# Altium schematic sheet Battery.SchDoc
size A4
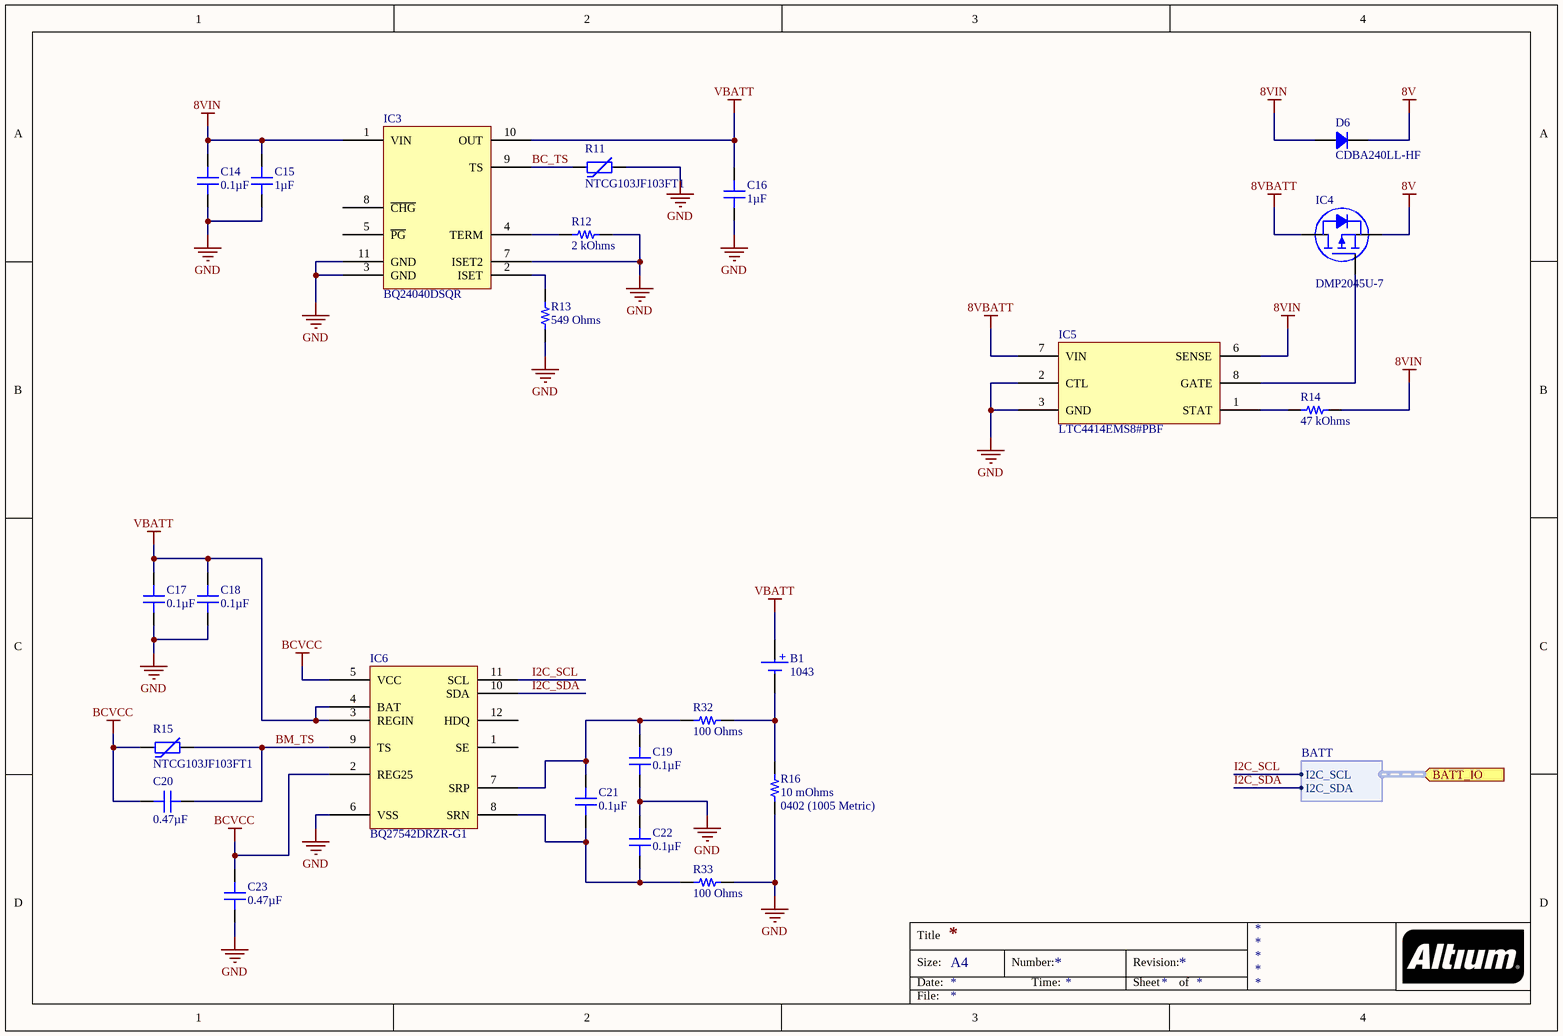
[diagram p0: Battery.SchDoc]

## Parts
B1  1043  [KEYSTONE 1043]
C14  0.1µF  [CAP 0201_0603]
C15  1µF  [CAP 0402_1005]
C16  1µF  [CAP 0402_1005]
C17  0.1µF  [CAP 0201_0603]
C18  0.1µF  [CAP 0201_0603]
C19  0.1µF  [CAP 0201_0603]
C20  0.47µF  [CAP 0201_0603]
C21  0.1µF  [CAP 0201_0603]
C22  0.1µF  [CAP 0201_0603]
C23  0.47µF  [CAP 0201_0603]
D6  CDBA240LL-HF  [DO214AC SMA]
IC3  BQ24040DSQR  [TI PWSON-10 DSQ]
IC4  DMP2045U-7  [DIODES SOT-23-3]
IC5  LTC4414EMS8#PBF  [ANALOG MSOP-8 RM-8]
IC6  BQ27542DRZR-G1  [TI SON-12 DRZ]
R11  NTCG103JF103FT1  [NTC 0402_1005]
R12  2 kOhms  [RES 0201_0603]
R13  549 Ohms  [RES 0201_0603]
R14  47 kOhms  [RES 0201_0603]
R15  NTCG103JF103FT1  [NTC 0402_1005]
R16  10 mOhms  Package / Case: 0402 (1005 Metric)  [STACKPOLE CSR0402]
R32  100 Ohms  [RES 0201_0603]
R33  100 Ohms  [RES 0201_0603]

## Ports
BATT_IO (in, harness BATT)

## Harnesses
BATT: I2C_SCL, I2C_SDA

## Nets
8V: D6.2 IC4.2(S)
8VBATT: IC4.3(D) IC5.7(VIN)
8VIN: C14.2 C15.2 D6.1 IC3.1(VIN) IC5.6(SENSE) R14.2
BCVCC: C20.1 C23.2 IC6.2(REG25) IC6.5(VCC) R15.1
GND: C14.1 C15.1 C16.1 C17.1 C18.1 C19.1 C22.2 C23.1 IC3.3(GND) IC3.7(ISET2) IC3.11(GND) IC5.2(CTL) IC5.3(GND) IC6.6(VSS) R11.2 R12.2 R13.1 R16.1 R33.2
VBATT: B1.1(+) C16.2 C17.2 C18.2 IC3.10(OUT) IC6.3(REGIN) IC6.4(BAT)
BC_TS: IC3.9(TS) R11.1
BM_TS: C20.2 IC6.9(TS) R15.2
I2C_SCL: IC6.11(SCL) ; port BATT_IO.I2C_SCL
I2C_SDA: IC6.10(SDA) ; port BATT_IO.I2C_SDA
NetB1_2: B1.2(-) R16.2 R32.2
NetC19_2: C19.2 C21.2 IC6.7(SRP) R32.1
NetC21_1: C21.1 C22.1 IC6.8(SRN) R33.1
NetIC3_2: IC3.2(ISET) R13.2
NetIC3_4: IC3.4(TERM) R12.1
NetIC4_1: IC4.1(G) IC5.8(GATE)
NetIC5_1: IC5.1(STAT) R14.1

Not connected (* = marked no-connect by the designer): IC3 5(~{PG}) 8(~{CHG}); IC6 1(SE) 12(HDQ)

## Notes on the sheet
- Title
- Size:
- Date:
- A4
- Number:
- Time:
- Revision:
- Sheet
- of
- File:

## Library data of the parts
B1 = 1043: BATTERY HOLDER 18650 PC PIN; Manufacturer: Keystone Electronics; Battery Cell Size: 18650; Battery Type, Function: Cylindrical, Holder; Number of Cells: 1; Style: Holder (Open); Part Number: 1043; ComponentLink1Description: Datasheet; ComponentLink1URL: http://keyelco.com/userAssets/file/M65p27.pdf; ComponentLink2Description: DigiKey Link; ComponentLink2URL: http://digikey.com/product-detail/en/keystone-electronics/1043/36-1043-ND/2745669; Height Above Board: 0.585" (14.86mm); LastUpdated: 02/02/2020 09:19:56; Lifecycle Status: Active; Minimum Order: 1; Mounting Type: PCB, Through Hole; Operating Temperature: -50°C ~ 145°C; Packaging: Unknown; PartId: 2; Part Status: Active; Price: 2.58; Series: -; Supplier 1: DigiKey; Supplier Part Number 1: 36-1043-ND; Termination Style: PC Pin
C14 C17-C19 C21 C22 = GRM033R61C104ME84D: CAP CER 0.1UF 16V X5R 0201; Manufacturer: Murata Electronics; Tolerance: ±20%; Part Number: GRM033R61C104ME84D; Value: 0.1µF; Applications: General Purpose; Capacitance: 0.1µF; ComponentLink1Description: Datasheet; ComponentLink1URL: https://search.murata.co.jp/Ceramy/image/img/A01X/G101/ENG/GRM033R61C104ME84-01.pdf; ComponentLink2Description: DigiKey Link; ComponentLink2URL: http://digikey.com/product-detail/en/murata-electronics/GRM033R61C104ME84D/490-9986-1-ND/5026291; Device Package: 0201 (0603 Metric); LastUpdated: 21/01/2020 00:00:12; Lifecycle Status: Active; Minimum Order: 1; Mounting Type: Surface Mount, MLCC; Operating Temperature: -55°C ~ 85°C; Package / Case: 0201 (0603 Metric); Packaging: TapeAndReel; PartId: 1522; Part Status: Active; Price: 0.01; Series: GRM; Size / Dimension: 0.024" L x 0.012" W (0.60mm x 0.30mm); Supplier 1: DigiKey; Supplier Part Number 1: 490-9986-1-ND; Temperature Coefficient: X5R; Thickness (Max): 0.013" (0.33mm); Voltage - Rated: 16V
C15 C16 = GRM155R61C105MA12D: CAP CER 1UF 16V X5R 0402; Manufacturer: Murata Electronics; Tolerance: ±20%; Part Number: GRM155R61C105MA12D; Value: 1µF; Applications: General Purpose; Capacitance: 1µF; ComponentLink1Description: Datasheet; ComponentLink1URL: https://search.murata.co.jp/Ceramy/image/img/A01X/G101/ENG/GRM155R61C105MA12-01.pdf; ComponentLink2Description: DigiKey Link; ComponentLink2URL: http://digikey.com/product-detail/en/murata-electronics/GRM155R61C105MA12D/490-14599-1-ND/6606205; Device Package: 0402 (1005 Metric); LastUpdated: 01/04/2020 23:56:41; Lifecycle Status: Active; Minimum Order: 1; Mounting Type: Surface Mount, MLCC; Operating Temperature: -55°C ~ 85°C; Package / Case: 0402 (1005 Metric); Packaging: TapeAndReel; PartId: 10295; Part Status: Active; Price: 0.01; Series: GRM; Size / Dimension: 0.039" L x 0.020" W (1.00mm x 0.50mm); Supplier 1: DigiKey; Supplier Part Number 1: 490-14599-1-ND; Temperature Coefficient: X5R; Thickness (Max): 0.022" (0.55mm); Voltage - Rated: 16V
C20 C23 = GRM033R60J474ME90D: CAP CER 0.47UF 6.3V X5R 0201; Manufacturer: Murata Electronics; Tolerance: ±20%; Part Number: GRM033R60J474ME90D; Value: 0.47µF; Applications: General Purpose; Capacitance: 0.47µF; ComponentLink1Description: Datasheet; ComponentLink1URL: https://search.murata.co.jp/Ceramy/image/img/A01X/G101/ENG/GRM033R60J474ME90-01.pdf; ComponentLink2Description: DigiKey Link; ComponentLink2URL: http://digikey.com/product-detail/en/murata-electronics/GRM033R60J474ME90D/490-10410-1-ND/5026287; Device Package: 0201 (0603 Metric); LastUpdated: 21/01/2020 00:00:17; Lifecycle Status: Active; Minimum Order: 1; Mounting Type: Surface Mount, MLCC; Operating Temperature: -55°C ~ 85°C; Package / Case: 0201 (0603 Metric); Packaging: TapeAndReel; PartId: 705; Part Status: Active; Price: 0.02; Series: GRM; Size / Dimension: 0.024" L x 0.012" W (0.60mm x 0.30mm); Supplier 1: DigiKey; Supplier Part Number 1: 490-10410-1-ND; Temperature Coefficient: X5R; Thickness (Max): 0.013" (0.33mm); Voltage - Rated: 6.3V
D6 = CDBA240LL-HF: DIODE SCHOTTKY 40V 2A DO214AC; Manufacturer: Comchip Technology; Capacitance @ Vr, F: 160pF @ 4V, 1MHz; Current - Average Rectified (Io): 2A (DC); Current - Reverse Leakage @ Vr: 1mA @ 40V; Speed: Fast Recovery =< 500ns, > 200mA (Io); Voltage - Forward (Vf) (Max) @ If: 350mV @ 2A; Part Number: CDBA240LL-HF; ComponentLink1Description: Datasheet; ComponentLink1URL: http://www.comchiptech.com/admin/files/product/CDBA240LL-HF RevC514247.pdf; ComponentLink2Description: DigiKey Link; ComponentLink2URL: http://digikey.com/product-detail/en/comchip-technology/CDBA240LL-HF/641-1698-1-ND/5226081; Device Package: DO-214AC, SMA; Diode Type: Schottky; LastUpdated: 02/02/2020 10:17:39; Lifecycle Status: Active; Minimum Order: 1; Mounting Type: Surface Mount; Operating Temperature - Junction: -55°C ~ 100°C; Package / Case: DO-214AC, SMA; Packaging: TapeAndReel; PartId: 2082; Part Status: Active; Price: 0.15; Series: -; Supplier 1: DigiKey; Supplier Part Number 1: 641-1698-1-ND; Supplier Device Package: DO-214AC (SMA); Voltage - DC Reverse (Vr) (Max): 40V
IC3 = BQ24040DSQR: IC BATT CHG LI-ION 1 CELL 10SON; Manufacturer: Texas Instruments; Battery Chemistry: Lithium Ion/Polymer; Battery Pack Voltage: 4.2V; Charge Current - Max: 1A; Current - Charging: Constant - Programmable; Fault Protection: Over Temperature, Over Voltage, Short Circuit; Number of Cells: 1; Programmable Features: Current; Voltage - Supply (Max): 28V; Part Number: BQ24040DSQR; ComponentLink1Description: Datasheet; ComponentLink1URL: http://www.ti.com/general/docs/suppproductinfo.tsp?distId=10&gotoUrl=http%3A%2F%2Fwww.ti.com%2Flit%2Fgpn%2Fbq24040; ComponentLink2Description: DigiKey Link; ComponentLink2URL: //digikey.com/product-detail/en/texas-instruments/BQ24040DSQR/296-37142-2-ND/2231631; Device Package: 10-WFDFN Exposed Pad; LastUpdated: 03/12/2019 23:44:47; Lifecycle Status: 0; Minimum Order: 1; Mounting Type: Surface Mount; Operating Temperature: -40°C ~ 85°C (TA); Package / Case: 10-WFDFN Exposed Pad; Packaging: TapeAndReel; PartId: 3; Part Status: Active; Price: 0.49; Series: -; Supplier 1: DigiKey; Supplier Part Number 1: 296-37142-2-ND; Supplier Device Package: 10-SON (2x2)
IC4 = DMP2045U-7: MOSFET P-CHAN 24V SOT23; Manufacturer: Diodes Incorporated; Current - Continuous Drain (Id) @ 25°C: 4.3A (Ta); Drain to Source Voltage (Vdss): 20V; Drive Voltage (Max Rds On,  Min Rds On): 1.8V, 4.5V; FET Type: P-Channel; Gate Charge (Qg) (Max) @ Vgs: 6.8nC @ 4.5V; Input Capacitance (Ciss) (Max) @ Vds: 634pF @ 10V; Power Dissipation (Max): 800mW (Ta); Rds On (Max) @ Id, Vgs: 45mOhm @ 4A, 4.5V; Vgs (Max): ±8V; Vgs(th) (Max) @ Id: 1V @ 250µA; Part Number: DMP2045U-7; ComponentLink1Description: Datasheet; ComponentLink1URL: https://www.diodes.com/assets/Datasheets/DMP2045U.pdf; ComponentLink2Description: DigiKey Link; ComponentLink2URL: http://digikey.com/product-detail/en/diodes-incorporated/DMP2045U-7/DMP2045U-7DICT-ND/8275359; Device Package: TO-236-3, SC-59, SOT-23-3; LastUpdated: 21/01/2020 04:00:36; Lifecycle Status: Active; Minimum Order: 1; Mounting Type: Surface Mount; Operating Temperature: -55°C ~ 150°C (TJ); Package / Case: TO-236-3, SC-59, SOT-23-3; Packaging: TapeAndReel; Part Status: Active; Price: 0.08; Series: -; Supplier 1: DigiKey; Supplier Part Number 1: DMP2045U-7DICT-ND; Supplier Device Package: SOT-23; Technology: MOSFET (Metal Oxide)
IC5 = LTC4414EMS8#PBF: IC OR CTRLR SRC SELECT 8MSOP; Manufacturer: Linear Technology/Analog Devices; Current - Supply: 33µA; Delay Time - OFF: 20µs; Delay Time - ON: 600µs; FET Type: P-Channel; Internal Switch(s): No; Ratio - Input:Output: 2:1; Voltage - Supply: 3V ~ 36V; Applications: Battery Backup, Industrial/Automotive, High Current Switch; ComponentLink1Description: Datasheet; ComponentLink1URL: http://www.linear.com/docs/9037; ComponentLink2Description: DigiKey Link; ComponentLink2URL: http://digikey.com/product-detail/en/linear-technology-analog-devices/LTC4414EMS8-PBF/LTC4414EMS8-PBF-ND/1620230; Device Package: 8-TSSOP, 8-MSOP (0.118", 3.00mm Width); LastUpdated: 02/02/2020 11:30:26; Lifecycle Status: Active; Part Number: LTC4414EMS8#PBF; Minimum Order: 1; Mounting Type: Surface Mount; Operating Temperature: -40°C ~ 85°C; Package / Case: 8-TSSOP, 8-MSOP (0.118", 3.00mm Width); Packaging: Tube; Part Status: Active; Price: 4.49; Series: PowerPath™; Supplier 1: DigiKey; Supplier Part Number 1: LTC4414EMS8#PBF-ND; Supplier Device Package: 8-MSOP; Type: Source Selector Switch
IC6 = BQ27542DRZR-G1: IC BATT FUEL GAUGE LI-ION 12SON; Manufacturer: Texas Instruments; Battery Chemistry: Lithium-Ion; Function: Battery Monitor; Interface: HDQ, I²C; Number of Cells: 1; Part Number: BQ27542DRZR-G1; ComponentLink1Description: Datasheet; ComponentLink1URL: http://www.ti.com/general/docs/suppproductinfo.tsp?distId=10&gotoUrl=http%3A%2F%2Fwww.ti.com%2Flit%2Fgpn%2Fbq27542-g1; ComponentLink2Description: DigiKey Link; ComponentLink2URL: http://digikey.com/product-detail/en/texas-instruments/BQ27542DRZR-G1/296-44346-1-ND/6110619; Device Package: 12-VFDFN Exposed Pad; LastUpdated: 30/03/2020 16:23:27; Lifecycle Status: Active; Minimum Order: 1; Mounting Type: Surface Mount; Operating Temperature: -40°C ~ 85°C (TA); Package / Case: 12-VFDFN Exposed Pad; Packaging: TapeAndReel; Part Status: Active; Price: 1.28; Series: Impedance Track™; Supplier 1: DigiKey; Supplier Part Number 1: 296-44346-1-ND; Supplier Device Package: 12-SON (2.5x4)
R11 R15 = NTCG103JF103FT1: THERMISTOR NTC 10KOHM 3380K 0402; Manufacturer: TDK Corporation; B25/85: 3435K; B Value Tolerance: ±1%; Power - Max: 100mW; Resistance in Ohms @ 25°C: 10k; Part Number: NTCG103JF103FT1; B25/50: 3380K; ComponentLink1Description: Datasheet; ComponentLink1URL: https://product.tdk.com/info/en/catalog/datasheets/503021/tpd_commercial_ntc-thermistor_ntcg_en.pdf?ref_disty=digikey; ComponentLink2Description: DigiKey Link; ComponentLink2URL: http://digikey.com/product-detail/en/tdk-corporation/NTCG103JF103FT1/445-2550-1-ND/934249; Device Package: 0402 (1005 Metric); LastUpdated: 21/01/2020 03:30:28; Lifecycle Status: Active; Minimum Order: 1; Mounting Type: Surface Mount; Operating Temperature: -40°C ~ 125°C; Package / Case: 0402 (1005 Metric); Packaging: TapeAndReel; PartId: 199; Part Status: Active; Price: 0.03; Resistance Tolerance: ±1%; Series: NTCG; Supplier 1: DigiKey; Supplier Part Number 1: 445-2550-1-ND
R12 = ERJ-1GNF2001C: RES SMD 2K OHM 1% 1/20W 0201; Manufacturer: Panasonic Electronic Components; Power (Watts): 0.05W, 1/20W; Temperature Coefficient: ±200ppm/°C; Part Number: ERJ-1GNF2001C; Value: 2 kOhms; ComponentLink1Description: Datasheet; ComponentLink1URL: https://industrial.panasonic.com/cdbs/www-data/pdf/RDA0000/AOA0000C304.pdf; ComponentLink2Description: DigiKey Link; ComponentLink2URL: http://digikey.com/product-detail/en/panasonic-electronic-components/ERJ-1GNF2001C/P122812CT-ND/8342563; Composition: Thick Film; Device Package: 0201 (0603 Metric); Features: Automotive AEC-Q200; Height - Seated (Max): 0.010" (0.26mm); LastUpdated: 21/01/2020 00:04:11; Lifecycle Status: Active; Minimum Order: 1; Number of Terminations: 2; Operating Temperature: -55°C ~ 125°C; Package / Case: 0201 (0603 Metric); Packaging: TapeAndReel; PartId: 3463; Part Status: Active; Price: 0.01; Ratings: AEC-Q200; Resistance: 2 kOhms; Series: ERJ; Size / Dimension: 0.024" L x 0.012" W (0.60mm x 0.30mm); Supplier 1: DigiKey; Supplier Part Number 1: P122812CT-ND; Supplier Device Package: 0201; Tolerance: ±1%
R13 = ERJ-1GNF5490C: RES SMD 549 OHM 1% 1/20W 0201; Manufacturer: Panasonic Electronic Components; Power (Watts): 0.05W, 1/20W; Temperature Coefficient: ±200ppm/°C; Part Number: ERJ-1GNF5490C; Value: 549 Ohms; ComponentLink1Description: Datasheet; ComponentLink1URL: https://industrial.panasonic.com/cdbs/www-data/pdf/RDA0000/AOA0000C304.pdf; ComponentLink2Description: DigiKey Link; ComponentLink2URL: http://digikey.com/product-detail/en/panasonic-electronic-components/ERJ-1GNF5490C/P123070CT-ND/8343079; Composition: Thick Film; Device Package: 0201 (0603 Metric); Features: Automotive AEC-Q200; Height - Seated (Max): 0.010" (0.26mm); LastUpdated: 21/01/2020 00:04:10; Lifecycle Status: Active; Minimum Order: 1; Number of Terminations: 2; Operating Temperature: -55°C ~ 125°C; Package / Case: 0201 (0603 Metric); Packaging: TapeAndReel; PartId: 4182; Part Status: Active; Price: 0.01; Ratings: AEC-Q200; Resistance: 549 Ohms; Series: ERJ; Size / Dimension: 0.024" L x 0.012" W (0.60mm x 0.30mm); Supplier 1: DigiKey; Supplier Part Number 1: P123070CT-ND; Supplier Device Package: 0201; Tolerance: ±1%
R14 = ERJ-1GNF4702C: RES SMD 47K OHM 1% 1/20W 0201; Manufacturer: Panasonic Electronic Components; Power (Watts): 0.05W, 1/20W; Temperature Coefficient: ±200ppm/°C; Part Number: ERJ-1GNF4702C; Value: 47 kOhms; ComponentLink1Description: Datasheet; ComponentLink1URL: https://industrial.panasonic.com/cdbs/www-data/pdf/RDA0000/AOA0000C304.pdf; ComponentLink2Description: DigiKey Link; ComponentLink2URL: http://digikey.com/product-detail/en/panasonic-electronic-components/ERJ-1GNF4702C/P123032CT-ND/8343003; Composition: Thick Film; Device Package: 0201 (0603 Metric); Features: Automotive AEC-Q200; Height - Seated (Max): 0.010" (0.26mm); LastUpdated: 21/01/2020 00:04:13; Lifecycle Status: Active; Minimum Order: 1; Number of Terminations: 2; Operating Temperature: -55°C ~ 125°C; Package / Case: 0201 (0603 Metric); Packaging: TapeAndReel; PartId: 2322; Part Status: Active; Price: 0.01; Ratings: AEC-Q200; Resistance: 47 kOhms; Series: ERJ; Size / Dimension: 0.024" L x 0.012" W (0.60mm x 0.30mm); Supplier 1: DigiKey; Supplier Part Number 1: P123032CT-ND; Supplier Device Package: 0201; Tolerance: ±1%
R16 = ERJ-2LWFR010X: RES 0.01 OHM 1% 1/5W 0402; Manufacturer: Panasonic Electronic Components; Power (Watts): 0.2W, 1/5W; Temperature Coefficient: 0/ +500ppm/°C; Part Number: ERJ-2LWFR010X; ComponentLink1Description: Datasheet; ComponentLink1URL: https://industrial.panasonic.com/cdbs/www-data/pdf/RDN0000/AOA0000C313.pdf; ComponentLink2Description: DigiKey Link; ComponentLink2URL: http://digikey.com/product-detail/en/panasonic-electronic-components/ERJ-2LWFR010X/P19181CT-ND/6004536; Composition: Thick Film; Device Package: 0402 (1005 Metric); Features: Current Sense; Height - Seated (Max): 0.018" (0.45mm); LastUpdated: 21/01/2020 02:16:15; Lifecycle Status: Active; Minimum Order: 1; Number of Terminations: 2; Operating Temperature: -55°C ~ 125°C; Packaging: TapeAndReel; PartId: 348; Part Status: Active; Price: 0.05; Resistance: 10 mOhms; Series: ERJ; Size / Dimension: 0.039" L x 0.020" W (1.00mm x 0.50mm); Supplier 1: DigiKey; Supplier Part Number 1: P19181CT-ND; Supplier Device Package: 0402; Tolerance: ±1%; Value: 10 mOhms
R32 R33 = RK73H1HTTC1000F: RES 100 OHM 1% 1/20W 0201; Manufacturer: KOA Speer Electronics, Inc.; Power (Watts): 0.05W, 1/20W; Temperature Coefficient: ±200ppm/°C; Part Number: RK73H1HTTC1000F; Value: 100 Ohms; ComponentLink1Description: Datasheet; ComponentLink1URL: http://www.koaspeer.com/catimages/Products/RK73H/RK73H.pdf; ComponentLink2Description: DigiKey Link; ComponentLink2URL: http://digikey.com/product-detail/en/koa-speer-electronics-inc/RK73H1HTTC1000F/2019-RK73H1HTTC1000FCT-ND/9845801; Composition: Thick Film; Device Package: 0201 (0603 Metric); Features: Automotive AEC-Q200, Moisture Resistant; Height - Seated (Max): 0.010" (0.26mm); LastUpdated: 21/01/2020 00:04:16; Lifecycle Status: Active; Minimum Order: 1; Number of Terminations: 2; Operating Temperature: -55°C ~ 155°C; Package / Case: 0201 (0603 Metric); Packaging: TapeAndReel; PartId: 1552; Part Status: Active; Price: 0.01; Ratings: AEC-Q200; Resistance: 100 Ohms; Series: RK73H; Size / Dimension: 0.024" L x 0.012" W (0.60mm x 0.30mm); Supplier 1: DigiKey; Supplier Part Number 1: 2019-RK73H1HTTC1000FCT-ND; Supplier Device Package: 0201; Tolerance: ±1%